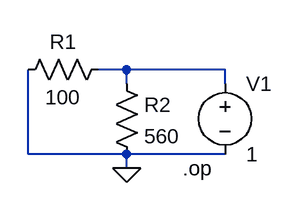
[diagram p0: schematic Thevenin_2_3.asc]
Thevenin_2_3.asc, the LTspice schematic file:
Version 4
SHEET 1 880 680
WIRE 144 112 112 112
WIRE 256 112 144 112
WIRE 144 128 144 112
WIRE 256 128 256 112
WIRE 32 208 32 112
WIRE 144 208 32 208
WIRE 256 208 144 208
WIRE 144 224 144 208
FLAG 144 224 0
SYMBOL res 128 96 R90
WINDOW 0 0 56 VBottom 2
WINDOW 3 32 56 VTop 2
SYMATTR InstName R1
SYMATTR Value 100
SYMBOL res 128 112 R0
SYMATTR InstName R2
SYMATTR Value 560
SYMBOL voltage 256 112 R0
WINDOW 123 0 0 Left 0
WINDOW 39 0 0 Left 0
SYMATTR InstName V1
SYMATTR Value 1
TEXT 208 224 Left 2 !.op

The netlist it stands for:
* Thevenin_2_3.asc
R1 N001 0 100
R2 N001 0 560
V1 N001 0 1
.op
.backanno
.end